# Altium schematic sheet 01 - Overview.SchDoc
size A4; DocumentNumber: 1; SheetNumber: 1; SheetTotal: 3; SchemaTitle: Overview
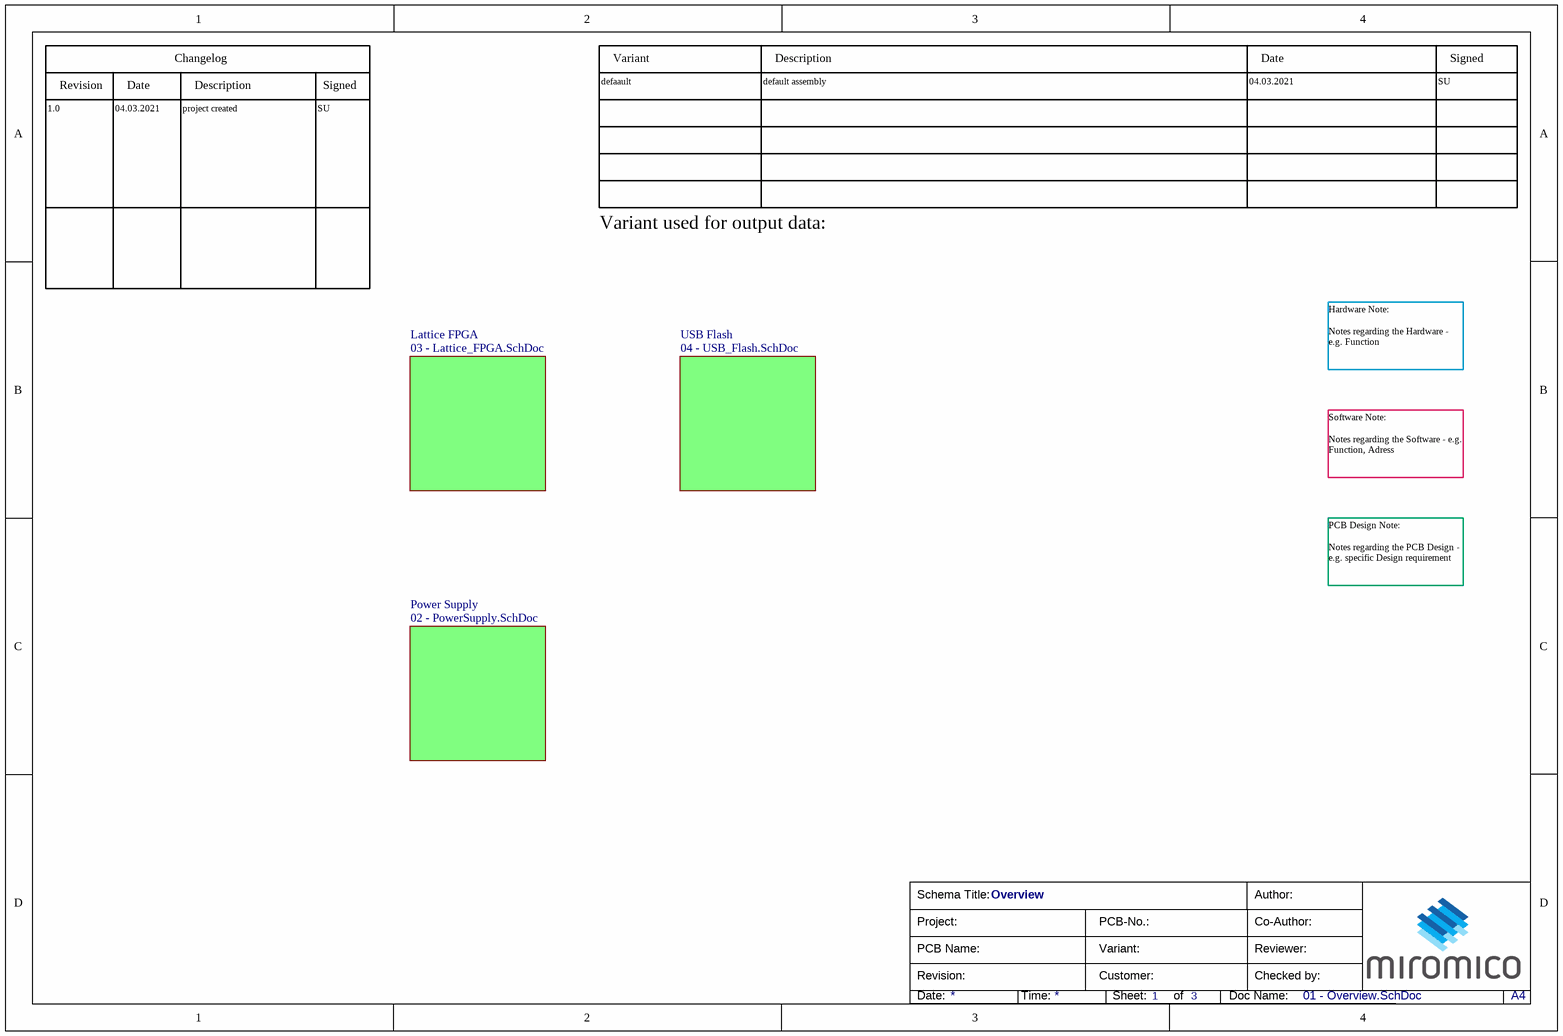
[diagram p0: 01 - Overview.SchDoc]

## Sub-sheets
Lattice FPGA = 03 - Lattice_FPGA.SchDoc: no entries
Power Supply = 02 - PowerSupply.SchDoc: no entries
USB Flash = 04 - USB_Flash.SchDoc: no entries

## Notes on the sheet
- Revision
- Date
- Changelog
- Description
- Signed
- defaault
- Variant
- default assembly
- 04.03.2021
- SU
- 1.0
- project created
- Variant used for output data:
- Hardware Note:
  Notes regarding the Hardware - e.g. Function
- Software Note:
  Notes regarding the Software - e.g. Function, Adress
- PCB Design Note:
  Notes regarding the PCB Design - e.g. specific Design requirement
- Schema Title:
- Project:
- PCB-No.:
- Author:
- Co-Author:
- Revision:
- PCB Name:
- Customer:
- Variant:
- Reviewer:
- Checked by:
- Date:
- Time:
- Sheet:
- of
- Doc Name:
- A4